# EasyEDA Pro project 4090_Portable_Fan.epro, board 电池连接小板
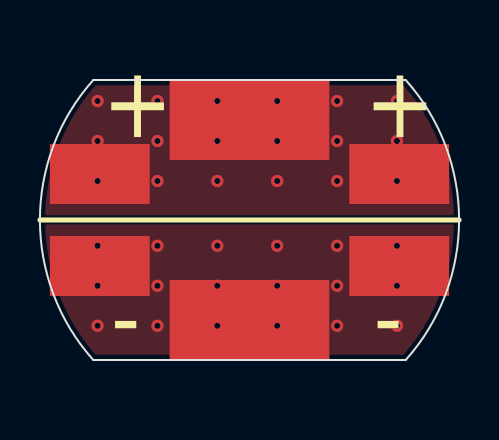
[diagram p10: board, top side]
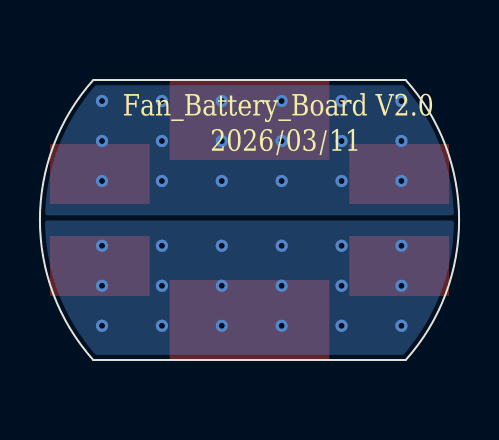
[diagram p11: board, bottom side, seen from below]

Outline 21 x 14 mm; copper layers: Top Layer, Bottom Layer. Coordinates in mm from the lower left corner of the outline.
Outline path: 2.67,14 18.33,14 arc(21,7) 18.33,0 2.67,0 arc(0,7) 2.67,14
Stack: Top Layer 0.035mm / Dielectric1 1.51mm FR4 er 4.5 / Bottom Layer 0.035mm

## Design rules (mm)
spacing copperThickness1oz (default): track to track 0.102, other pairs 0.152 to 0.3
spacing copperThickness2oz: track to track 0.203, other pairs 0.152 to 0.3
track width copperThickness1oz (default): min 0.127, default 0.254, max 2.54
track width copperThickness2oz: min 0.203, default 0.254, max 2.54
differential pair differentialPair (default): width min 0.127, default 0.254, max 2.54; gap min 0.152, default 0.152

## Placement (name value [footprint] x y rotation side)
NOREF  -  [Pad_e5]  18 4.7 0 top
NOREF#2  -  [Pad_e1]  3 4.7 0 top
NOREF#3  -  [Pad_e6]  18 9.3 0 top
NOREF#4  -  [Pad_e3]  10.5 2 0 top
NOREF#5  -  [Pad_e2]  3 9.3 0 top
NOREF#6  -  [Pad_e4]  10.5 12 0 top

## Footprints (pads in the part's own frame, mm; a bottom-side part is the same pattern mirrored in y, then rotated)
Pad_e1
  rect 5x3 smd: 22(0,0)
Pad_e2
  rect 5x3 smd: 22(0,0)
Pad_e3
  rect 8x4 smd: 22(0,0)
Pad_e4
  rect 8x4 smd: 22(0,0)
Pad_e5
  rect 5x3 smd: 22(0,0)
Pad_e6
  rect 5x3 smd: 22(0,0)

## Nets
GND: NOREF#3.22 NOREF#5.22 NOREF#6.22
VBAT-: NOREF.22 NOREF#2.22 NOREF#4.22

## Via types
v1: diameter 0.61, hole 0.305, Top Layer to Bottom Layer, 36 vias

## Routing (per net, layer and track width the routed paths; a pad name or vN(x,y) marks a point on that pad's centre or on a via; arc(x,y) is an arc through that point)
GND:
  vias: v1(2.89,12.95) v1(2.89,10.95) v1(2.89,8.95) v1(5.89,12.95) v1(5.89,10.95) v1(5.89,8.95) v1(8.89,12.95) v1(8.89,10.95) v1(8.89,8.95) v1(11.89,12.95) v1(11.89,10.95) v1(11.89,8.95) v1(14.89,12.95) v1(14.89,10.95) v1(14.89,8.95) v1(17.89,12.95) v1(17.89,10.95) v1(17.89,8.95)
VBAT-:
  vias: v1(2.89,5.71) v1(2.89,3.71) v1(2.89,1.71) v1(5.89,5.71) v1(5.89,3.71) v1(5.89,1.71) v1(8.89,5.71) v1(8.89,3.71) v1(8.89,1.71) v1(11.89,5.71) v1(11.89,3.71) v1(11.89,1.71) v1(14.89,5.71) v1(14.89,3.71) v1(14.89,1.71) v1(17.89,5.71) v1(17.89,3.71) v1(17.89,1.71)

## Copper pours and planes (outline as drawn; the poured copper is in the pictures)
GND on Top Layer: -4.35,14.22 23.84,14.22 23.84,7.24 -4.35,7.24
GND on Bottom Layer: -4.22,14.09 23.97,14.09 23.97,7.24 -4.22,7.24
VBAT- on Top Layer: -5.51,6.78 23.08,6.78 23.08,-0.77 -5.51,-0.77
VBAT- on Bottom Layer: -4.68,7.07 23.91,7.07 23.91,-0.47 -4.68,-0.47

## Text on the board
Bottom Silkscreen Layer: Fan_Battery_Board V2.0 / 2026/03/11
Top Silkscreen Layer: + | -
